# EAGLE design Sensor_Board_0x06_CO2_S8_v1 (EAGLE 8.4.2)
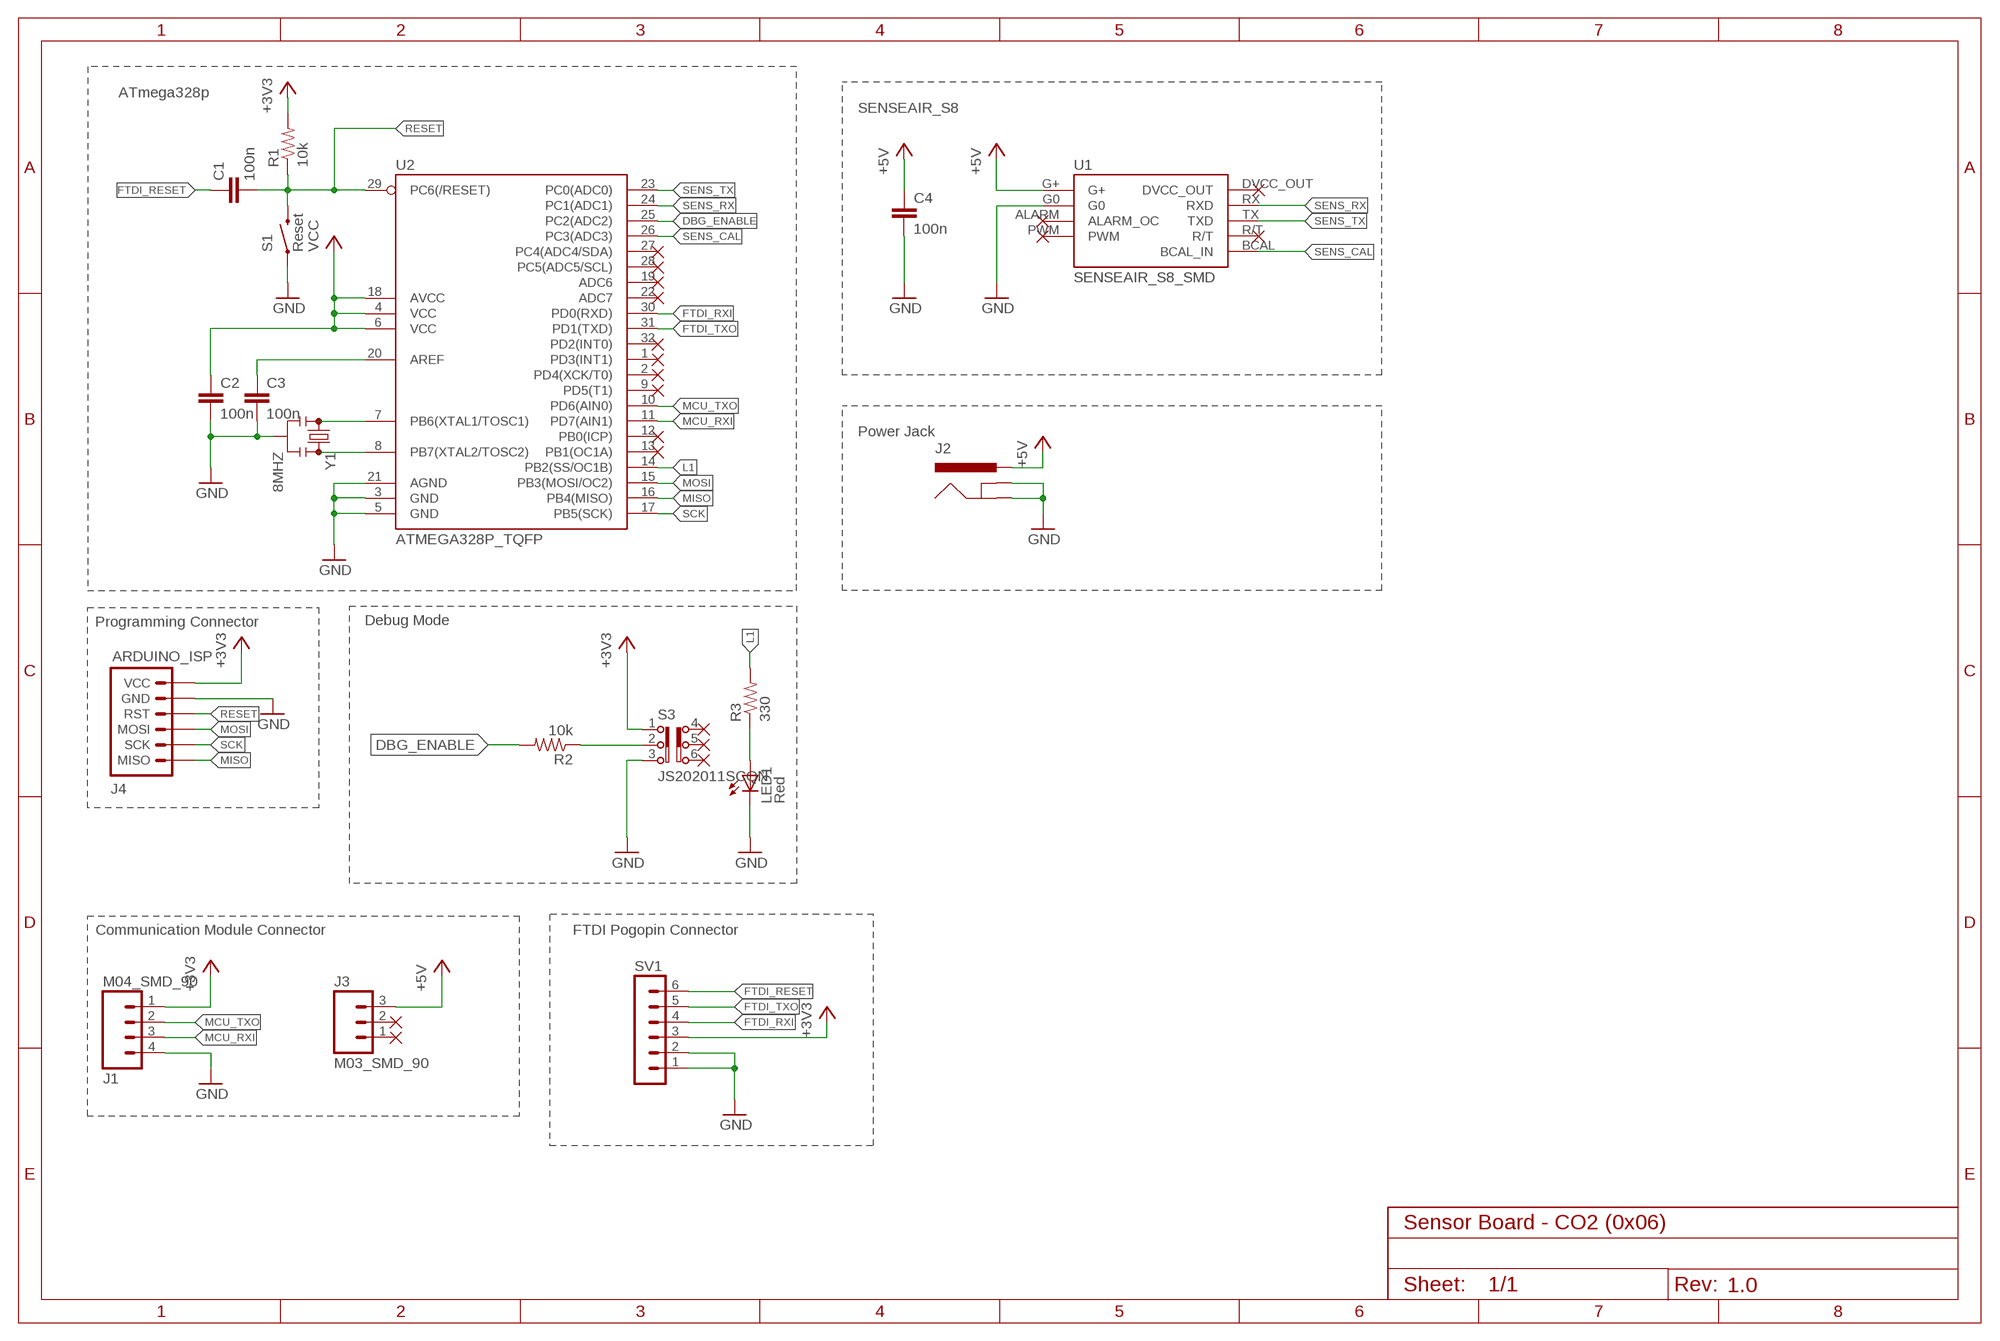
[diagram p0: schematic, sheet 1]
FRAME1 (FRAME-A4L): CNAME: Communication Module; CREVISION: 2.0

## Parts
C1  100n  C  [C0805]
C2  100n  C  [C0805]
C3  100n  C  [C0805]
C4  100n  C  [C0805]
J1  M04_SMD_90  [M04_SMD_90]
J2  5.5x2.1mm Barrel  POWER_JACKSMD  [POWER_JACK_SMD]
J3  M03_SMD_90  [M03_SMD_90]
J4  ARDUINO_ISP  [M-2X3]
LED1  Red  LEDSML0805  [SML0805]
R1  10k  RESISTOR0805-RES  [0805]
R2  10k  RESISTOR0805-RES  [0805]
R3  330  RESISTOR0805-RES  [0805]
S1  Reset  PUSHBUTTON  [M-PUSHBUTTON-SMD]
S3  JS202011SCQN  [JS202011SCQN]
SV1  MA06-1  [MA06-1]
U1  SENSEAIR_S8_SMD  [SENSEAIR_S8_SMD]
U2  ATMEGA328P_TQFP  [TQFP32-08]
Y1  8MHZ  RESONATOR8MHZ  [RESONATOR-SMD]

## Nets
+3V3 [Vsupply]: C2.1 J1.1 J4.P$6(VCC) R1.2 S3.1 SV1.3 U2.4(VCC) U2.6(VCC) U2.18(AVCC) ; supply symbol labelled VCC
+5V [Vsupply]: C4.1 J2.VIN0(PWR) J2.VIN1(PWR) J3.3 U1.G+
DBG_ENABLE: R2.2 U2.25(PC2(ADC2))
FTDI_RESET: C1.1 SV1.6
FTDI_RXI: SV1.4 U2.30(PD0(RXD))
FTDI_TXO: SV1.5 U2.31(PD1(TXD))
GND [GND]: C2.2 C3.2 C4.2 J1.4 J2.GND(GNDBREAK) J2.P$4(GND) J4.P$5(GND) LED1.C S1.1(LEFT) S1.2(LEFT) S3.3 SV1.1 SV1.2 U1.G0 U2.3(GND) U2.5(GND) U2.21(AGND) Y1.2
L1: R3.2 U2.14(PB2(SS/OC1B))
MCU_RXI: J1.3 U2.11(PD7(AIN1))
MCU_TXO: J1.2 U2.10(PD6(AIN0))
MISO: J4.P$1(MISO) U2.16(PB4(MISO))
MOSI: J4.P$3(MOSI) U2.15(PB3(MOSI/OC2))
N$1: U2.8(PB7(XTAL2/TOSC2)) Y1.3
N$2: U2.7(PB6(XTAL1/TOSC1)) Y1.1
N$4: R2.1 S3.2
N$15: C3.1 U2.20(AREF)
N$30: LED1.A R3.1
RESET: C1.2 J4.P$4(RST) R1.1 S1.3(RIGHT) S1.4(RIGHT) U2.29(PC6(/RESET))
SCK: J4.P$2(SCK) U2.17(PB5(SCK))
SENS_CAL: U1.BCAL(BCAL_IN) U2.26(PC3(ADC3))
SENS_RX: U1.RX(RXD) U2.24(PC1(ADC1))
SENS_TX: U1.TX(TXD) U2.23(PC0(ADC0))
Unconnected: J3.1 J3.2 S3.4 S3.5 S3.6 U1.ALARM(ALARM_OC) U1.DVCC_OUT U1.PWM U1.R/T U2.1(PD3(INT1)) U2.2(PD4(XCK/T0)) U2.9(PD5(T1)) U2.12(PB0(ICP)) U2.13(PB1(OC1A)) U2.19(ADC6) U2.22(ADC7) U2.27(PC4(ADC4/SDA)) U2.28(PC5(ADC5/SCL)) U2.32(PD2(INT0))

## Notes on the sheet
- ATmega328p
- SENSEAIR_S8
- Power Jack
- Programming Connector | Debug Mode
- Communication Module Connector | FTDI Pogopin Connector
- Sensor Board - CO2 (0x06)
- 1.0

## Library data of the parts
C1-C4 = eagle-ltspice:C: CAPACITOR, European symbol; SPICEMODEL: NONE; SPICEPREFIX: C
J1 = myownthings:M04_SMD_90
J2 = wsn:POWER_JACK: Power Jack This is the standard 5.5mm barrel jack for power. The PTH is the most common, proven, reliable, footprint. The Slot footprint only works if the mill layer is transmitted to the PCB fab house so be warned. Mating wall wart : TOL-00298 (and others); PROD_ID: CONN-08106; SF_ID: PRT-12748
J3 = myownthings:M03_SMD_90
J4 = marc_library:ARDUINO_ISP: AVR ISP 6-pin inline header for Arduino ISP
LED1 = led:LED: LED OSRAM: - CHIPLED LG R971, LG N971, LY N971, LG Q971, LY Q971, LO R971, LY R971 LH N974, LH R974 LS Q976, LO Q976, LY Q976 LO Q996 - Hyper CHIPLED LW Q18S LB Q993, LB Q99A, LB R99A - SideLED LS A670, LO A670, LY A670, LG A670, LP A670 LB A673, LV A673, LT A673, LW A673 LH A674 LY A675 LS A676, LA A676, LO A676, LY A676, LW A676 LS A679, LY A679, LG A679 - Hyper Micro SIDELED® LS Y876, LA Y876, LO Y876, LY Y876 LT Y87S - SmartLED LW L88C, LW L88S LB L89C, LB L89S, LG L890 LS L89K, LO L89K, LY L89K LS L896, LA L896, LO L896, LY L896 - TOPLED LS T670, LO T670, LY T670, LG T670, LP T670 LSG T670, LSP T670, LSY T670, LOP T670, LYG T670 LG T671, LOG T671, LSG T671 LB T673, LV T673, LT T673, LW T673 LH T674 LS T676, LA T676, LO T676, LY T676, LB T676, LH T676, LSB T676, LW T676 LB T67C, LV T67C, LT T67C, LS T67K, LO T67K, LY T67K, LW E67C LS E67B, LA E67B, LO E67B, LY E67B, LB E67C, LV E67C, LT E67C LW T67C LS T679, LY T679, LG T679 LS T770, LO T770, LY T770, LG T770, LP T770 LB T773, LV T773, LT T773, LW T773 LH T774 LS E675, LA E675, LY E675, LS T675 LS T776, LA T776, LO T776, LY T776, LB T776 LHGB T686 LT T68C, LB T68C - Hyper Mini TOPLED® LB M676 - Mini TOPLED Santana® LG M470 LS M47K, LO M47K, LY M47K Source: http://www.osram.convergy.de LUXEON: - LUMILED® LXK2-PW12-R00, LXK2-PW12-S00, LXK2-PW14-U00, LXK2-PW14-V00 LXK2-PM12-R00, LXK2-PM12-S00, LXK2-PM14-U00 LXK2-PE12-Q00, LXK2-PE12-R00, LXK2-PE12-S00, LXK2-PE14-T00, LXK2-PE14-U00 LXK2-PB12-K00, LXK2-PB12-L00, LXK2-PB12-M00, LXK2-PB14-N00, LXK2-PB14-P00, LXK2-PB14-Q00 LXK2-PR12-L00, LXK2-PR12-M00, LXK2-PR14-Q00, LXK2-PR14-R00 LXK2-PD12-Q00, LXK2-PD12-R00, LXK2-PD12-S00 LXK2-PH12-R00, LXK2-PH12-S00 LXK2-PL12-P00, LXK2-PL12-Q00, LXK2-PL12-R00 Source: www.luxeon.com KINGBRIGHT: KA-3528ASYC Source: www.kingbright.com
R1-R3 = SparkFun-Passives:RESISTOR: Resistor Basic schematic elements and footprints for 0603, 1206, and PTH resistors.
S1 = marc_library:PUSHBUTTON
S3 = myownthings:JS202011SCQN: DPDT SLIDE SWITCH
SV1 = con-lstb:MA06-1: PIN HEADER; OC_FARNELL: unknown; OC_NEWARK: unknown
U1 = myownthings:SENSEAIR_S8_SMD
U2 = marc_library:ATMEGA328P_TQFP; PROD_ID: IC-09069
Y1 = marc_library:RESONATOR: Resonator Small SMD resonator. Used, eg, on the Arduino Pro/ Pro Mini boards. 8MHz- XTAL-08895 16MHz- XTAL-08900; PROD_ID: XTAL-08895

## Net classes
0 default: width 0.3 mm
1 Vsupply: width 0.5 mm
5 GND: width 0.5 mm

## Board
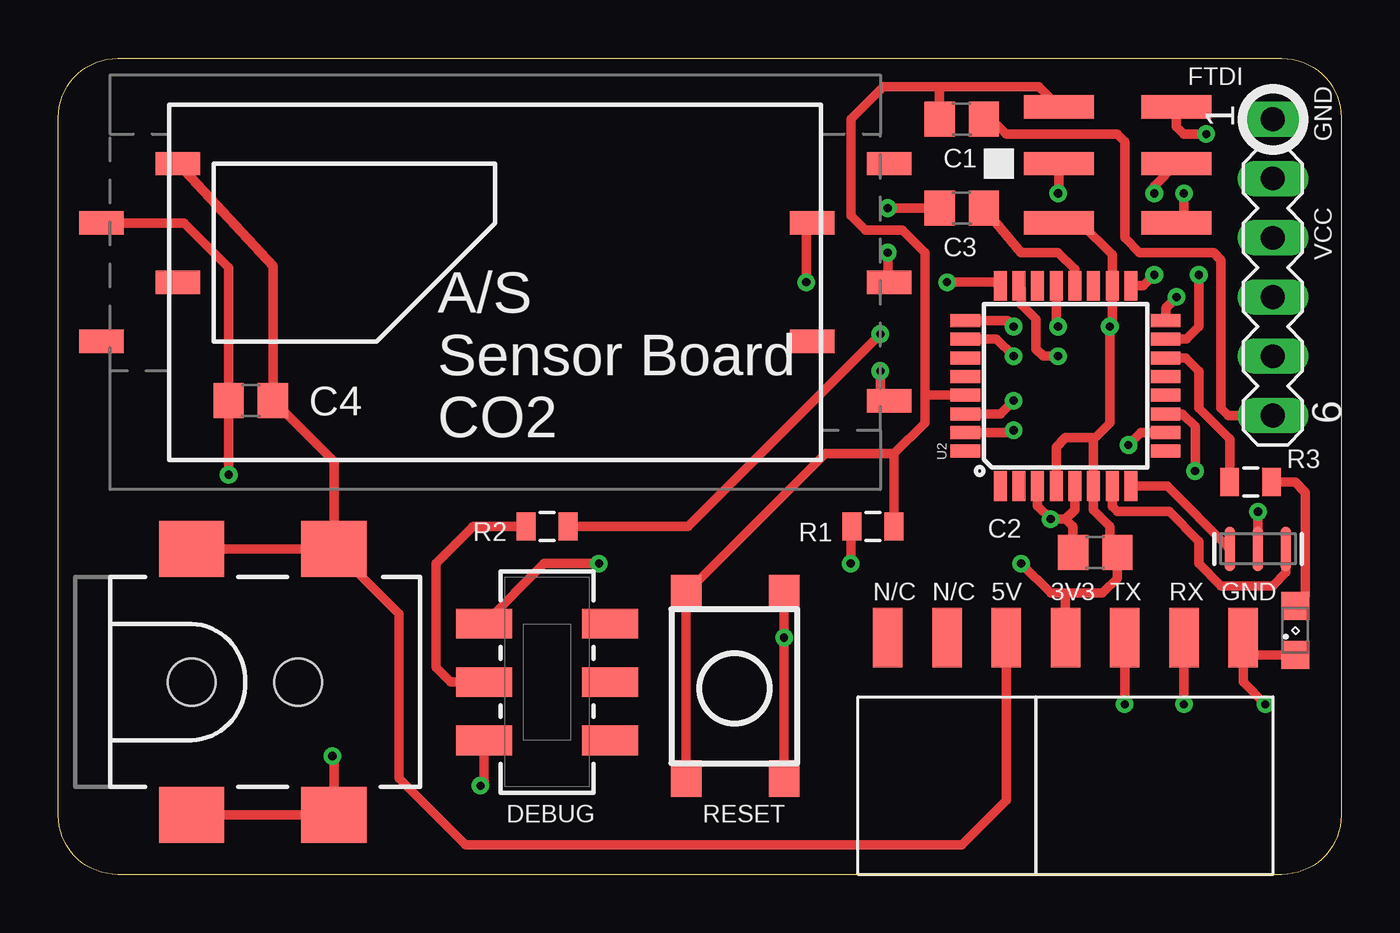
[diagram p1: board, top side]
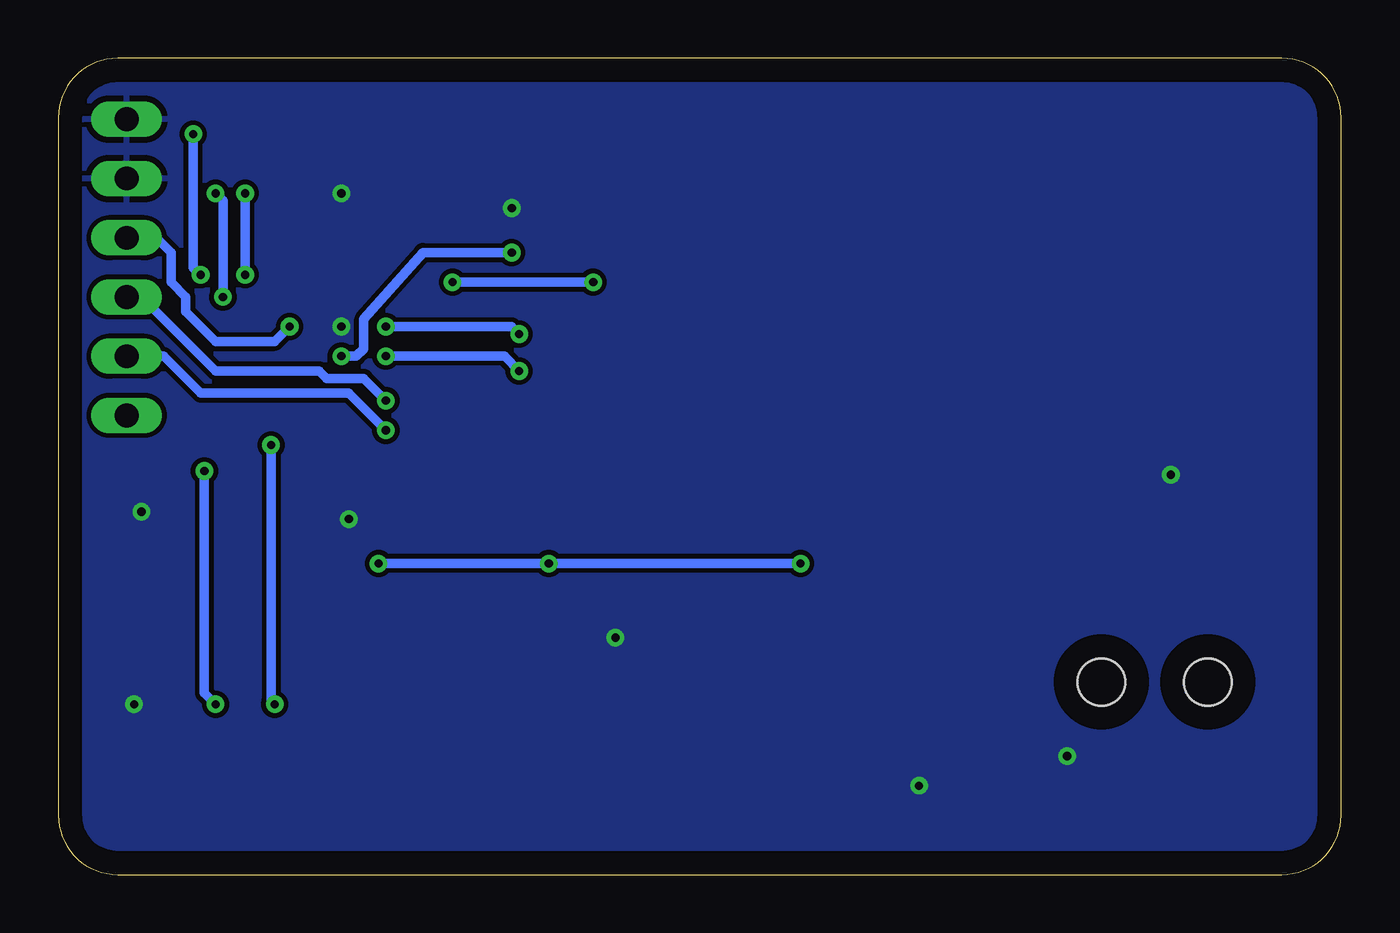
[diagram p2: board, bottom side, seen from below]

Size 55 x 35 mm. Coordinates in mm from the lower left corner, seen from the top.
Outline: 52.46,0 2.54,0 arc-90 0,2.54 0,32.46 arc-90 2.54,35 52.46,35 arc-90 55,32.46 55,2.54 arc-90 52.46,0
Copper layers (1*16): Top 0.035mm / dielectric 1.5mm / Bottom 0.035mm
Design rules "default *": minimum track width 14mil, minimum drill 24mil, track to track 8mil, track to pad 8mil, pad to pad 8mil, via to via 8mil, smd to smd 8mil, copper to edge 40mil, drill to drill 8mil, minimum pad ring 10mil, minimum via ring 8mil, stop-mask expansion 4mil, vias tented up to drill 0mil, thermal gap 10mil

### Footprints (pad centres in the part's own frame; a part is rotated, then mirrored left to right if it is on the bottom)
C0805 = smd 1.3 x 1.5: 1 -0.95,0; 2 0.95,0
M04_SMD_90 = smd 1.27 x 2.54: 1 0,0; 2 2.54,0; 3 5.08,0; 4 7.62,0
POWER_JACK_SMD = smd 2.8 x 2.4: GND 0,-5.7; P$4 6.1,-5.7; VIN0 0,5.7; VIN1 6.1,5.7 | hole 2.032: 0,0; 4.572,0
M03_SMD_90 = smd 1.27 x 2.54: 1 0,0; 2 2.54,0; 3 5.08,0
M-2X3 = smd 1 x 3: P$1 0,0; P$2 2.54,0; P$3 4.98,0; P$4 4.98,5.05; P$5 2.54,5.05; P$6 0,5.05
SML0805 = smd 1.2 x 1.2: A 1.05,0; C -1.05,0
0805 = smd 0.8 x 1.2: 1 -0.9,0; 2 0.9,0
M-PUSHBUTTON-SMD = smd 1.55 x 1.3: 1 0,0; 2 7.95,0; 3 0,-4.2; 4 7.95,-4.2
JS202011SCQN = smd 1.27 x 2.4: 1 -2.5,-2.7; 2 0,-2.7; 3 2.5,-2.7; 4 -2.5,2.7; 5 0,2.7; 6 2.5,2.7
MA06-1 = drill 1.016 long: 1 -6.35,0; 2 -3.81,0; 3 -1.27,0; 4 1.27,0; 5 3.81,0; 6 6.35,0
SENSEAIR_S8_SMD = smd 1.91 x 1: ALARM -13.595,0; BCAL 16.885,-5.08; DVCC_OUT 16.885,5.08; G0 -16.885,2.54; G+ -13.595,5.08; PWM -16.885,-2.54; R/T 13.595,-2.54; RX 13.595,2.54; TX 16.885,0
TQFP32-08 = smd 1.27 x 0.559: 1 -4.293,2.8; 2 -4.293,2; 3 -4.293,1.2; 4 -4.293,0.4; 5 -4.293,-0.4; 6 -4.293,-1.2; 7 -4.293,-2; 8 -4.293,-2.8; 17 4.293,-2.8; 18 4.293,-2; 19 4.293,-1.2; 20 4.293,-0.4; 21 4.293,0.4; 22 4.293,1.2; 23 4.293,2; 24 4.293,2.8 | smd 0.559 x 1.27: 9 -2.8,-4.293; 10 -2,-4.293; 11 -1.2,-4.293; 12 -0.4,-4.293; 13 0.4,-4.293; 14 1.2,-4.293; 15 2,-4.293; 16 2.8,-4.293; 25 2.8,4.293; 26 2,4.293; 27 1.2,4.293; 28 0.4,4.293; 29 -0.4,4.293; 30 -1.2,4.293; 31 -2,4.293; 32 -2.8,4.293
RESONATOR-SMD = smd 0.45 x 1.905: 1 -1.2,0; 2 0,0; 3 1.2,0

### Placement (x,y rotation side)
C1  38.73,32.38 180 top
C2  44.45,13.81 180 top
C3  38.73,28.57 180 top
C4  8.26,20.32 180 top
J1  43.18,10.16 0 top
J2  5.71,8.26 0 top
J3  35.56,10.16 0 top
J4  47.94,27.94 90 top
LED1  53.02,10.48 90 top
R1  34.92,14.92 180 top
R2  20.95,14.92 0 top
R3  51.12,16.83 180 top
S1  31.11,12.06 270 top
S3  20.95,8.26 270 top
SV1  52.07,26.04 270 top
U1  18.73,25.4 0 top
U2  43.18,20.95 90 top
Y1  51.44,13.97 180 top

### Tracks (layer width: path | path; a pad name or v marks a point on that pad's centre or on a via)
+3V3  (via drill 0.35)
  Top 0.406: J4.P$6 43.81,27.94 45.18,26.57 U2.18 45.18,23.59 v45.09,23.5 45.09,19.37 44.38,18.66 | 44.38,18.66 U2.6 44.38,15.63 45.09,14.92 45.09,14.13 C2.1 45.4,12.7 44.77,12.06 43.18,12.06 | U2.4 42.78,18.33 43.18,18.73 44.31,18.73 44.38,18.66 | S3.1 20.84,13.34 v23.18,13.34 | v41.27,13.34 42.55,12.06 43.18,12.06 | J1.1 43.18,12.06 | v33.97,13.34 33.97,14.87 R1.2
  Bottom 0.406: SV1.3 50.8,27.3 50.16,26.67 50.16,25.4 49.53,24.77 49.53,24.13 48.26,22.86 45.72,22.86 v45.09,23.5 | v23.18,13.34 v33.97,13.34 v41.27,13.34
+5V
  Top 0.406: J3.3 40.64,3.17 38.73,1.27 17.46,1.27 14.61,4.13 14.61,11.16 J2.VIN1 | J2.VIN1 J2.VIN0 | J2.VIN1 11.81,17.71 C4.1 9.21,26.09 U1.G+
DBG_ENABLE  (via drill 0.35)
  Top 0.406: v40.96,23.5 40.7,23.75 U2.25 | R2.2 26.99,14.92 v35.24,23.18
  Bottom 0.406: v40.96,23.5 35.56,23.5 v35.24,23.18
FTDI_RESET
  Top 0.406: C1.1 39.69,32.7 40.64,31.75 45.4,31.75 45.72,31.43 45.72,27.3 46.35,26.67 49.53,26.67 49.85,26.35 49.85,20 50.16,19.68 SV1.6
FTDI_RXI  (via drill 0.35)
  Top 0.406: U2.30 40.39,19.75 v40.96,20.32
  Bottom 0.406: SV1.4 51.44,24.77 48.26,21.59 43.81,21.59 43.5,21.27 41.91,21.27 v40.96,20.32
FTDI_TXO  (via drill 0.35)
  Top 0.406: U2.31 40.86,18.95 v40.96,19.05
  Bottom 0.406: SV1.5 50.48,22.23 48.9,20.64 42.55,20.64 v40.96,19.05
GND  (via drill 0.35)
  Top 0.406: v42.86,29.21 42.89,29.24 J4.P$5 | v35.56,28.57 36.52,28.57 C3.2 | U2.21 42.78,23.58 v42.86,23.5 | Y1.2 v51.44,15.56 | 50.8,9.53 J1.4 | 50.8,9.53 50.8,8.26 v51.75,7.3 | LED1.C 50.9,9.43 50.8,9.53 | 43.18,15.24 v42.55,15.24 41.98,15.8 U2.3 | 43.18,15.24 43.58,15.64 U2.5 | C2.2 43.5,14.92 43.18,15.24 | S1.1 v31.11,10.16 S1.2 | v11.75,5.08 11.81,5.01 J2.P$4 J2.GND | S3.3 18.25,3.97 v18.1,3.81 | U1.G0 5.4,27.94 7.3,26.04 C4.2 v7.3,17.15 v7.3,17.14
  pour Bottom: 55,2.54 55,32.46 arc90 52.46,35 2.54,35 arc90 0,32.46 0,2.54 arc90 2.54,0 52.46,0 arc90
L1
  Top 0.406: U2.14 48.33,22.16 48.9,21.59 48.9,20 50.22,18.68 R3.2
MCU_RXI  (via drill 0.35)
  Top 0.406: U2.11 48.19,19.75 48.74,19.21 v48.74,17.3 | v48.26,7.3 J1.3
  Bottom 0.406: v48.74,17.3 48.74,7.78 v48.26,7.3
MCU_TXO  (via drill 0.35)
  Top 0.406: v45.88,18.41 46.42,18.95 U2.10 | v45.72,7.3 J1.2
  Bottom 0.406: v45.88,18.41 45.88,7.46 v45.72,7.3
MISO  (via drill 0.35)
  Top 0.406: v48.26,29.21 48.26,28.26 J4.P$1 | U2.16 47.47,24.3 v47.94,24.77
  Bottom 0.406: v47.94,24.77 47.94,28.89 v48.26,29.21
MOSI  (via drill 0.35)
  Top 0.406: U2.15 48.35,22.95 48.9,23.5 v48.9,25.72 | v49.21,31.75 48.26,31.75 47.94,32.07 J4.P$3
  Bottom 0.406: v48.9,25.72 49.21,26.04 v49.21,31.75
N$1
  Top 0.406: Y1.3 47.54,16.66 U2.8
N$2
  Top 0.406: Y1.1 52.63,12.95 52.07,12.38 49.85,12.38 48.9,13.34 48.9,14.29 47.62,15.56 45.4,15.56 45.18,15.78 U2.7
N$4
  Top 0.406: R2.1 17.78,14.92 16.19,13.34 16.19,8.89 16.83,8.26 S3.2
N$15
  Top 0.406: C3.1 41.27,26.67 42.86,26.67 43.58,25.95 U2.20
N$30
  Top 0.406: R3.1 53.02,16.83 53.46,16.39 53.46,11.97 LED1.A
RESET
  Top 0.406: 35.83,18.05 R1.1 | 35.83,18.05 37.15,19.37 37.15,20.64 | U2.29 37.23,20.55 37.15,20.64 | 35.83,18.05 32.9,18.05 S1.3 S1.4 | 37.78,33.78 42.03,33.78 J4.P$4 | 37.78,33.78 35.37,33.78 33.97,32.38 33.97,28.26 34.61,27.62 36.2,27.62 37.15,26.67 37.15,20.64 | C1.2 37.78,33.78
SCK  (via drill 0.35)
  Top 0.406: v46.99,25.72 46.52,25.25 U2.17 | v46.99,29.21 46.99,29.53 J4.P$2
  Bottom 0.406: v46.99,25.72 v46.99,29.21
SENS_CAL  (via drill 0.35)
  Top 0.406: U1.BCAL 35.24,20.38 v35.24,21.59 | v40.96,22.23 40.23,22.95 U2.26
  Bottom 0.406: v35.24,21.59 35.88,22.23 v40.96,22.23
SENS_RX  (via drill 0.35)
  Top 0.406: v32.07,25.4 32.07,27.68 U1.RX | U2.24 40.23,25.4 v38.1,25.4
  Bottom 0.406: v38.1,25.4 v32.07,25.4
SENS_TX  (via drill 0.35)
  Top 0.406: U2.23 41.29,25.13 41.29,24.44 41.91,23.83 41.91,22.54 42.23,22.23 v42.86,22.23 | 35.11,25.59 U1.TX 35.56,25.4 v35.56,26.67
  Bottom 0.406: v42.86,22.23 42.23,22.23 41.91,22.54 41.91,23.81 39.37,26.67 v35.56,26.67

### Text on the board
tPlace: FTDI | GND | VCC | A/S / Sensor Board / CO2 | N/C | N/C | 5V | 3V3 | TX | RX | GND | DEBUG | RESET